# EAGLE schematic PIC16 Training Board Breakout (EAGLE 9.7.0)
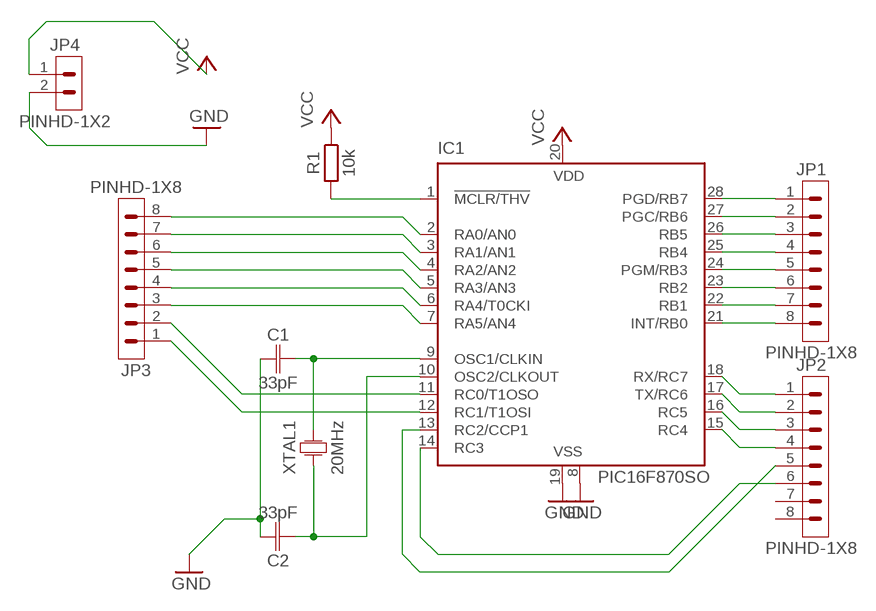
[diagram p0: schematic, sheet 1]

## Parts
C1  33pF  C_CHIP-0805(2012-METRIC)  [CAPC2012X110]
C2  33pF  C_CHIP-0805(2012-METRIC)  [CAPC2012X110]
IC1  PIC16F870SO  [SO28W]
JP1  PINHD-1X8  [1X08]
JP2  PINHD-1X8  [1X08]
JP3  PINHD-1X8  [1X08]
JP4  PINHD-1X2  [1X02]
R1  10k  RESISTOR__AXIAL-11.7MM-PITCH  [RESAD1176W63L850D250B]
XTAL1  20MHz  CRYSTAL_HC49-11L-13.5H  [XTALRR488W43L1135T465H1346B]

## Nets
GND: C1.2 C2.2 IC1.8(VSS) IC1.19(VSS) JP4.2
N$1: C1.1 IC1.9(OSC1/CLKIN) XTAL1.2
N$2: C2.1 IC1.10(OSC2/CLKOUT) XTAL1.1
N$4: IC1.1(!MCLR/THV) R1.2
N$5: IC1.28(PGD/RB7) JP1.1
N$6: IC1.27(PGC/RB6) JP1.2
N$7: IC1.26(RB5) JP1.3
N$8: IC1.25(RB4) JP1.4
N$9: IC1.24(PGM/RB3) JP1.5
N$10: IC1.23(RB2) JP1.6
N$11: IC1.22(RB1) JP1.7
N$12: IC1.21(INT/RB0) JP1.8
N$13: IC1.18(RX/RC7) JP2.1
N$14: IC1.17(TX/RC6) JP2.2
N$15: IC1.16(RC5) JP2.3
N$16: IC1.15(RC4) JP2.4
N$17: IC1.13(RC2/CCP1) JP2.5
N$18: IC1.14(RC3) JP2.6
N$19: IC1.2(RA0/AN0) JP3.8
N$20: IC1.3(RA1/AN1) JP3.7
N$21: IC1.4(RA2/AN2) JP3.6
N$22: IC1.5(RA3/AN3) JP3.5
N$23: IC1.6(RA4/T0CKI) JP3.4
N$24: IC1.7(RA5/AN4) JP3.3
N$25: IC1.11(RC0/T1OSO) JP3.2
N$26: IC1.12(RC1/T1OSI) JP3.1
VCC: IC1.20(VDD) JP4.1 R1.1
Unconnected: JP2.7 JP2.8

## Library data of the parts
C1 C2 = Capacitor:C: Capacitor - Generic
IC1 = microchip:PIC16*870: MICROCONTROLLER flash type
JP1-JP3 = Connector:PINHD-1X8: Pin Header
JP4 = Connector:PINHD-1X2: Pin Header
R1 = Tinkercad:RESISTOR: Resistor Fixed - Generic
XTAL1 = Frequency-Source:CRYSTAL: Crystal 2Pin - Generic